# EAGLE schematic MK-312BT V1.3B (EAGLE 6.6.0)

## Sheet 1 of 5: PSU
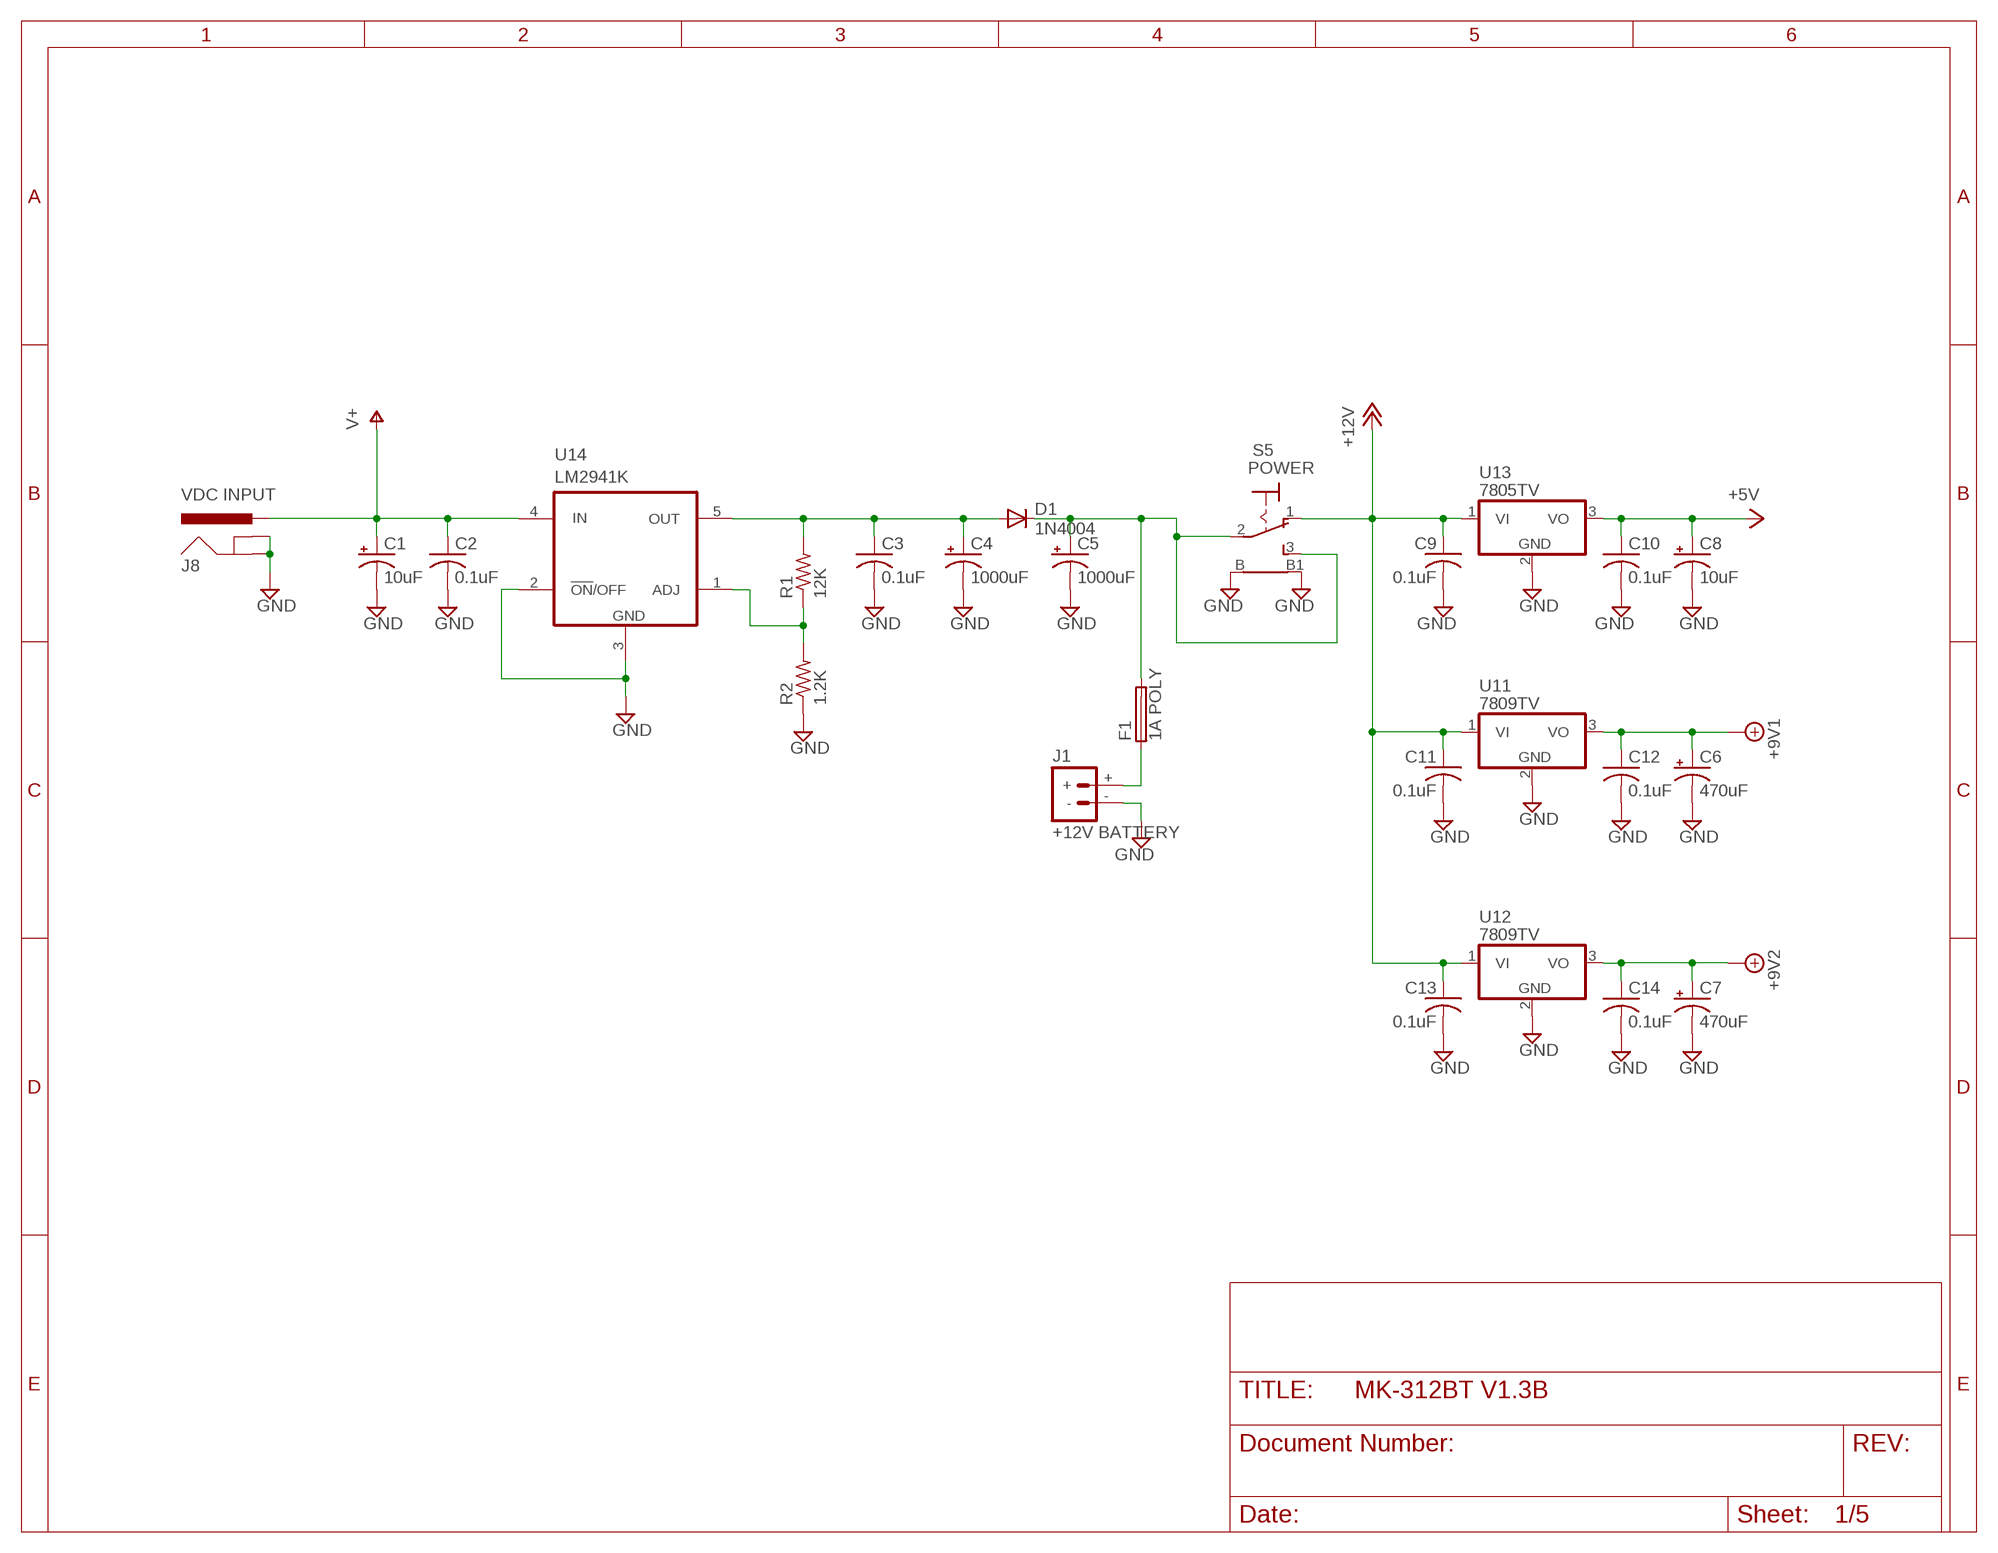
[diagram p0: schematic, sheet 1]

### Parts
C1  10uF  CPOL-USE2.5-7  [E2,5-7]
C2  0.1uF  C-US025-024X044  [C025-024X044]
C3  0.1uF  C-US025-024X044  [C025-024X044]
C4  1000uF  CPOL-USE5-10.5  [E5-10,5]
C5  1000uF  CPOL-USE5-10.5  [E5-10,5]
C6  470uF  CPOL-USE3.5-8  [E3,5-8]
C7  470uF  CPOL-USE3.5-8  [E3,5-8]
C8  10uF  CPOL-USE2.5-7  [E2,5-7]
C9  0.1uF  C-US025-024X044  [C025-024X044]
C10  0.1uF  C-US025-024X044  [C025-024X044]
C11  0.1uF  C-US025-024X044  [C025-024X044]
C12  0.1uF  C-US025-024X044  [C025-024X044]
C13  0.1uF  C-US025-024X044  [C025-024X044]
C14  0.1uF  C-US025-024X044  [C025-024X044]
D1  1N4004  [DO41-10]
F1  1A POLY  LITTLEFUSE  [LITTLEFUSE]
J1  +12V BATTERY  BATTERY_CONNDEANS  [DEANS]
J8  VDC INPUT  POWER_JACKSLT  [POWER_JACK_SLOT]
R1  12K  R-US_0207/10  [0207/10]
R2  1.2K  R-US_0207/10  [0207/10]
S5  POWER  LPV-1  [LPV-1]
U11  7809TV  7805TV  [TO220V]
U12  7809TV  7805TV  [TO220V]
U13  7805TV  [TO220V]
U14  LM2941K  [TO220-5KC]

### Nets
+5V: C8.+ C10.1 U13.3(VO) ; also sheet 2,3,4,5
+8V: C6.+ C12.1 U11.3(VO) ; supply symbol labelled +9V1 ; also sheet 5
+9V: C7.+ C14.1 U12.3(VO) ; supply symbol labelled +9V2 ; also sheet 5
+12V: C9.1 C11.1 C13.1 S5.1(O) U11.1(VI) U12.1(VI) U13.1(VI) ; also sheet 2
GND: C1.- C2.2 C3.2 C4.- C5.- C6.- C7.- C8.- C9.2 C10.2 C11.2 C12.2 C13.2 C14.2 J1.- J8.GND@1(GNDBREAK) J8.GND@2(GND) R2.1 S5.B S5.B1 U11.2(GND) U12.2(GND) U13.2(GND) U14.2(!ON!/OFF) U14.3(GND) ; also sheet 2,3,4,5
N$31: F1.1 J1.+
N$43: R1.1 R2.2 U14.1(ADJ)
N$45: C3.1 C4.+ D1.A R1.2 U14.5(OUT)
N$78: C5.+ D1.C F1.2 S5.2(P) S5.3(S)
V+: C1.+ C2.1 J8.PWR U14.4(IN) ; also sheet 2

## Sheet 2 of 5
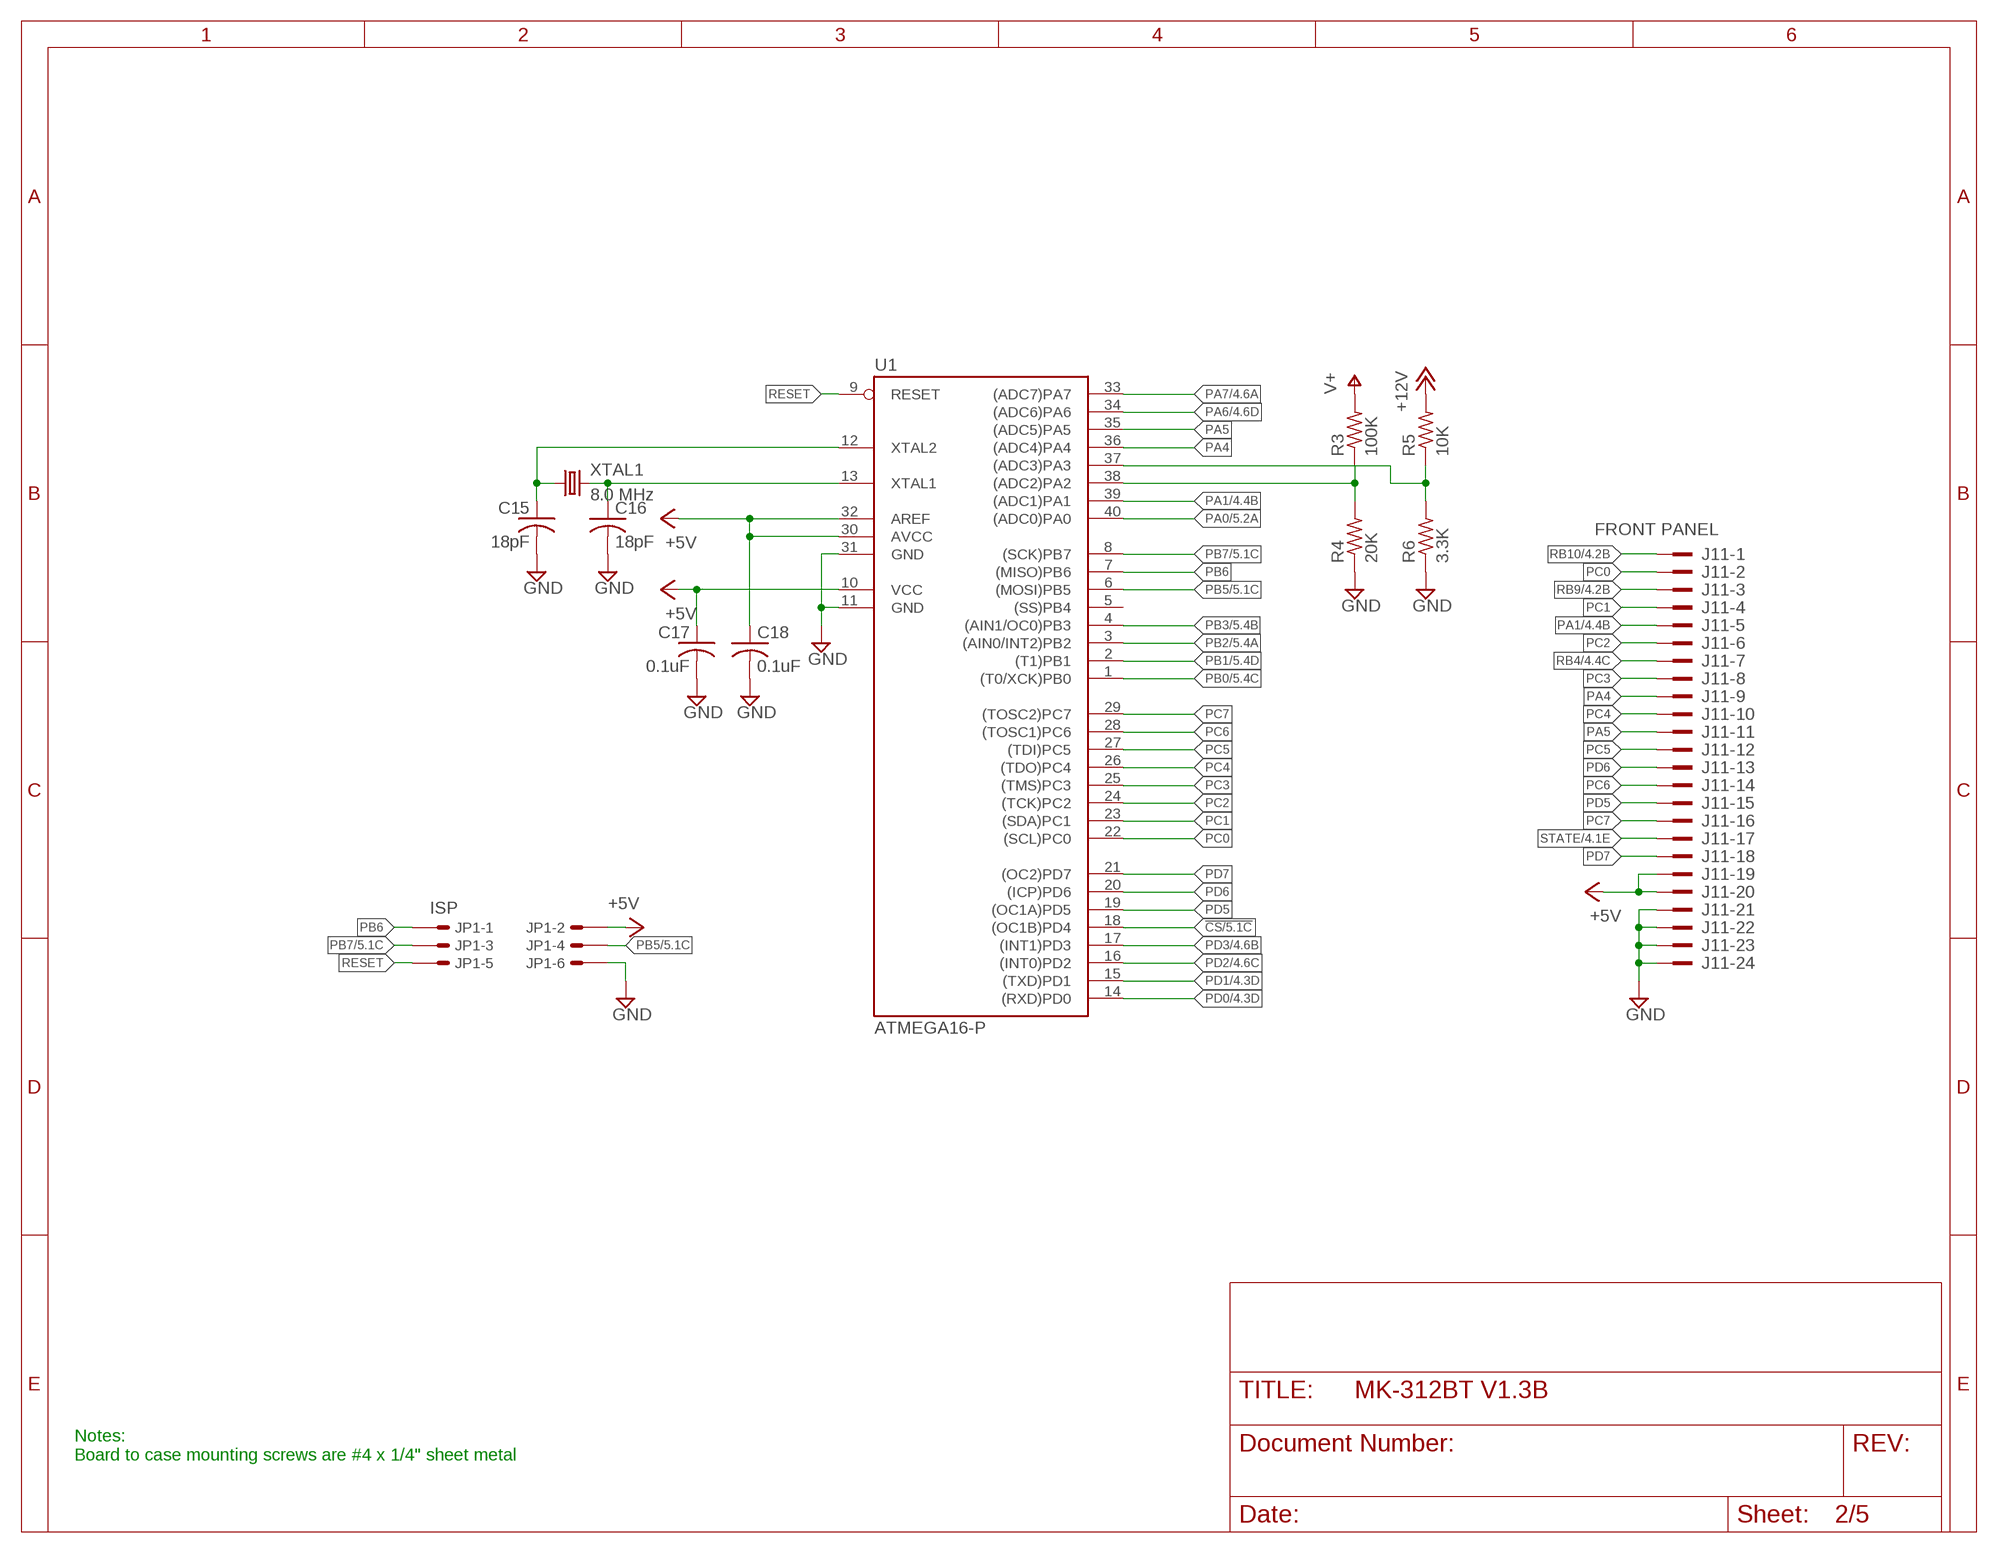
[diagram p1: schematic, sheet 2]

### Parts
C15  18pF  C-US025-024X044  [C025-024X044]
C16  18pF  C-US025-024X044  [C025-024X044]
C17  0.1uF  C-US025-024X044  [C025-024X044]
C18  0.1uF  C-US025-024X044  [C025-024X044]
J11  FRONT PANEL  2524-  [PAK100/2500-24]
JP1  ISP  057-006-1  [057-006-1]
R3  100K  R-US_0207/10  [0207/10]
R4  20K  R-US_0207/10  [0207/10]
R5  10K  R-US_0207/10  [0207/10]
R6  3.3K  R-US_0207/10  [0207/10]
U1  ATMEGA16-P  MEGA16-P  [DIL40]
XTAL1  8.0 MHz  CRYSTALHC49S  [HC49/S]

### Nets
!CS: U1.18((OC1B)PD4) ; also sheet 5
+5V: C17.1 C18.1 J11.19 J11.20 JP1.2 U1.10(VCC) U1.30(AVCC) U1.32(AREF) ; also sheet 1,3,4,5
+12V: R5.2 ; also sheet 1
GND: C15.2 C16.2 C17.2 C18.2 J11.21 J11.22 J11.23 J11.24 JP1.6 R4.1 R6.1 U1.11(GND) U1.31(GND) ; also sheet 1,3,4,5
N$2: R5.1 R6.2 U1.37((ADC3)PA3)
N$3: R3.1 R4.2 U1.38((ADC2)PA2)
N$17: C16.1 U1.13(XTAL1) XTAL1.2
N$32: C15.1 U1.12(XTAL2) XTAL1.1
PA0: U1.40((ADC0)PA0) ; also sheet 5
PA1: J11.5 U1.39((ADC1)PA1) ; also sheet 4
PA4: J11.9 U1.36((ADC4)PA4)
PA5: J11.11 U1.35((ADC5)PA5)
PA6: U1.34((ADC6)PA6) ; also sheet 4
PA7: U1.33((ADC7)PA7) ; also sheet 4
PB0: U1.1((T0/XCK)PB0) ; also sheet 5
PB1: U1.2((T1)PB1) ; also sheet 5
PB2: U1.3((AIN0/INT2)PB2) ; also sheet 5
PB3: U1.4((AIN1/OC0)PB3) ; also sheet 5
PB5: JP1.4 U1.6((MOSI)PB5) ; also sheet 5
PB6: JP1.1 U1.7((MISO)PB6)
PB7: JP1.3 U1.8((SCK)PB7) ; also sheet 5
PC0: J11.2 U1.22((SCL)PC0) ; also sheet 3
PC1: J11.4 U1.23((SDA)PC1) ; also sheet 3
PC2: J11.6 U1.24((TCK)PC2) ; also sheet 3
PC3: J11.8 U1.25((TMS)PC3) ; also sheet 3
PC4: J11.10 U1.26((TDO)PC4) ; also sheet 3
PC5: J11.12 U1.27((TDI)PC5) ; also sheet 3
PC6: J11.14 U1.28((TOSC1)PC6) ; also sheet 3
PC7: J11.16 U1.29((TOSC2)PC7) ; also sheet 3
PD0: U1.14((RXD)PD0) ; also sheet 4
PD1: U1.15((TXD)PD1) ; also sheet 4
PD2: U1.16((INT0)PD2) ; also sheet 4
PD3: U1.17((INT1)PD3) ; also sheet 4
PD5: J11.15 U1.19((OC1A)PD5) ; also sheet 3
PD6: J11.13 U1.20((ICP)PD6) ; also sheet 3
PD7: J11.18 U1.21((OC2)PD7) ; also sheet 3
RB4: J11.7 ; also sheet 4
RB9: J11.3 ; also sheet 4
RB10: J11.1 ; also sheet 4
RESET: JP1.5 U1.9(RESET)
STATE: J11.17 ; also sheet 4
V+: R3.2 ; also sheet 1
Unconnected: U1.5((SS)PB4)

### Notes on the sheet
- Notes:
  Board to case mounting screws are #4 x 1/4" sheet metal

## Sheet 3 of 5: Small PCB
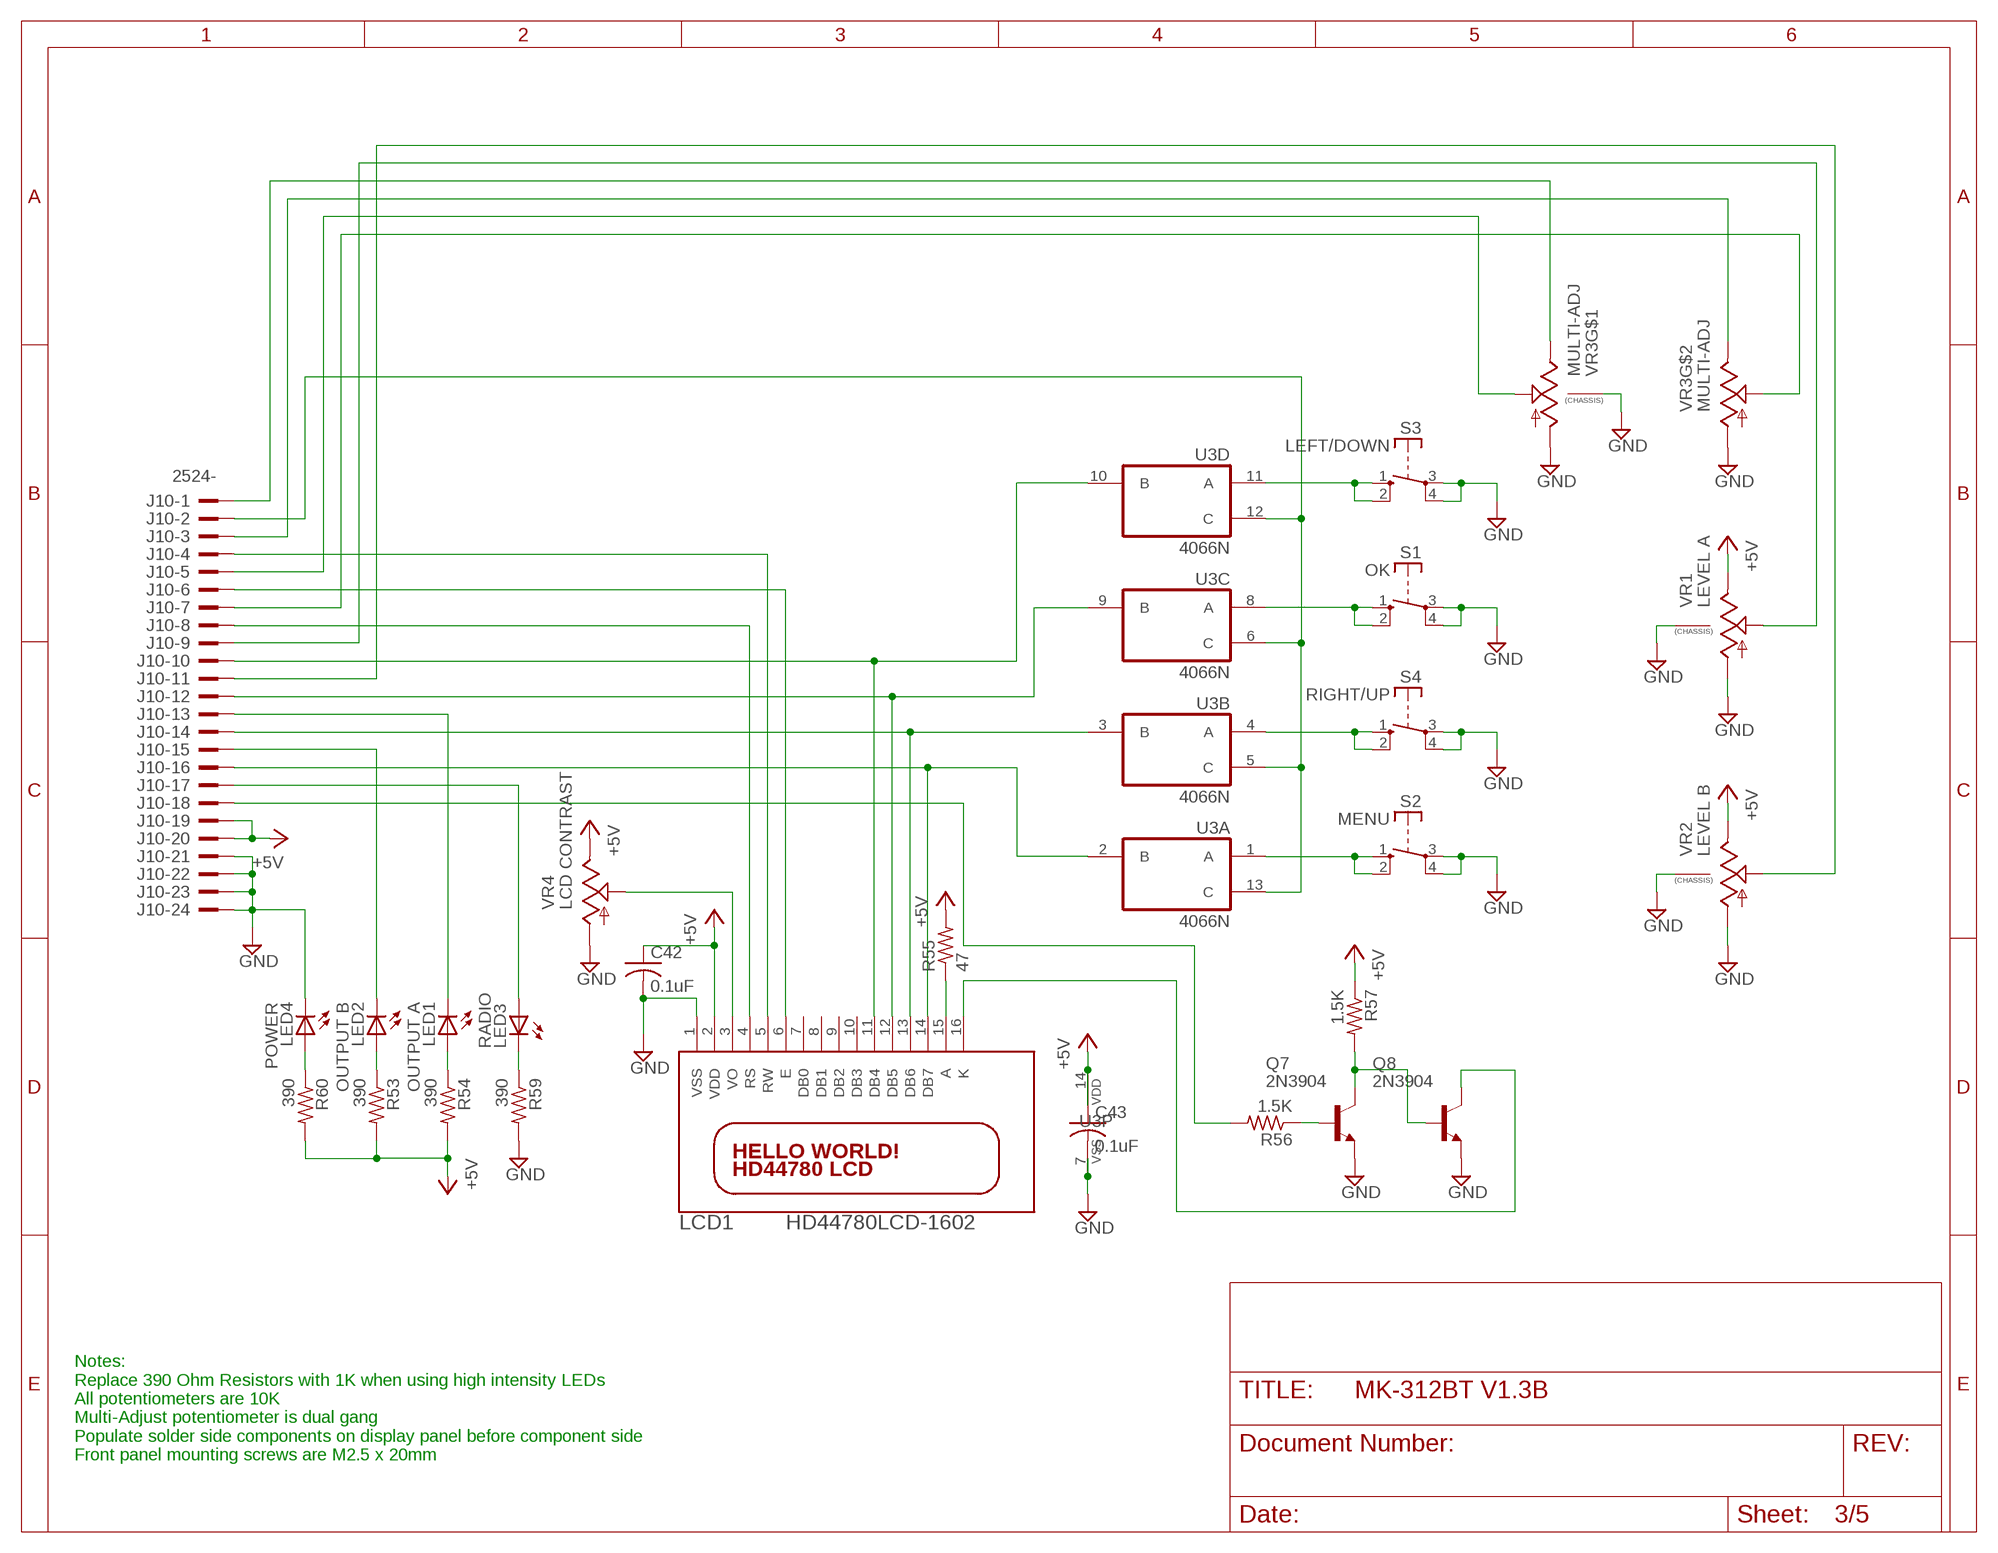
[diagram p2: schematic, sheet 3]

### Parts
C42  0.1uF  C-US025-024X044  [C025-024X044]
C43  0.1uF  C-US025-024X044  [C025-024X044]
J10  2524-  [PAK100/2500-24]
LCD1  HD44780LCD-1602  [LCD1602]
LED1  OUTPUT A  LED5MM  [LED5MM]
LED2  OUTPUT B  LED5MM  [LED5MM]
LED3  RADIO  LED5MM  [LED5MM]
LED4  POWER  LED5MM  [LED5MM]
Q7  2N3904  [TO92]
Q8  2N3904  [TO92]
R53  390  R-US_0207/10  [0207/10]
R54  390  R-US_0207/10  [0207/10]
R55  47  R-US_0207/10  [0207/10]
R56  1.5K  R-US_0207/10  [0207/10]
R57  1.5K  R-US_0207/10  [0207/10]
R59  390  R-US_0207/10  [0207/10]
R60  390  R-US_0207/10  [0207/10]
S1  OK  DTE6K  [DTE6K]
S2  MENU  DTE6K  [DTE6K]
S3  LEFT/DOWN  DTE6K  [DTE6K]
S4  RIGHT/UP  DTE6K  [DTE6K]
U3  4066N  [DIL14]
VR1  LEVEL A  9MM_SNAP-IN_POT_CHASSIS  [9MM_SNAP-IN_POT]
VR2  LEVEL B  9MM_SNAP-IN_POT_CHASSIS  [9MM_SNAP-IN_POT]
VR3  MULTI-ADJ  ALPHA-9MM-DUALPOT  [DUAL_9MM_SNAP-IN_POT]
VR4  LCD CONTRAST  TRIM_US-B25P  [B25P]

### Nets
+5V: C42.1 C43.1 J10.19 J10.20 LCD1.2(VDD) R53.2 R54.2 R55.2 R57.1 R60.2 U3.14(P:VDD) VR1.3(E) VR2.3(E) VR4.E ; also sheet 1,2,4,5
GND: C42.2 C43.2 J10.21 J10.22 J10.23 J10.24 LCD1.1(VSS) LED4.K(C) Q7.3(E) Q8.3(E) R59.2 S1.3(P) S1.4(P) S2.3(P) S2.4(P) S3.3(P) S3.4(P) S4.3(P) S4.4(P) U3.7(P:VSS) VR1.1(A) VR1.CHASSIS2 VR2.1(A) VR2.CHASSIS2 VR3.1(A) VR3.1B(A) VR3.CHASSIS1 VR3.CHASSIS2 VR4.A ; also sheet 1,2,4,5
N$1: J10.7 VR3.2B(S)
N$4: S1.1(S) S1.2(S) U3.8(C:A)
N$5: S3.1(S) S3.2(S) U3.11(D:A)
N$7: S4.1(S) S4.2(S) U3.4(B:A)
N$10: J10.3 VR3.3B(E)
N$11: J10.9 VR1.2(S)
N$12: J10.11 VR2.2(S)
N$13: J10.1 VR3.3(E)
N$15: J10.5 VR3.2(S)
N$23: LED2.A R53.1
N$29: LED1.A R54.1
N$30: LCD1.3(VO) VR4.S
N$47: LCD1.15(A) R55.1
N$79: LED3.K(C) R59.1
N$80: S2.1(S) S2.2(S) U3.1(A:A)
N$81: LED4.A R60.1
N$82: Q7.2(B) R56.1
N$83: Q7.1(C) Q8.2(B) R57.2
N$84: LCD1.16(K) Q8.1(C)
N$86: J10.17 LED3.A
PC0: J10.2 U3.5(B:C) U3.6(C:C) U3.12(D:C) U3.13(A:C) ; also sheet 2
PC1: J10.4 LCD1.5(RW) ; also sheet 2
PC2: J10.6 LCD1.6(E) ; also sheet 2
PC3: J10.8 LCD1.4(RS) ; also sheet 2
PC4: J10.10 LCD1.11(DB4) U3.10(D:B) ; also sheet 2
PC5: J10.12 LCD1.12(DB5) U3.9(C:B) ; also sheet 2
PC6: J10.14 LCD1.13(DB6) U3.3(B:B) ; also sheet 2
PC7: J10.16 LCD1.14(DB7) U3.2(A:B) ; also sheet 2
PD5: J10.15 LED2.K(C) ; also sheet 2
PD6: J10.13 LED1.K(C) ; also sheet 2
PD7: J10.18 R56.2 ; also sheet 2
Unconnected: LCD1.7(DB0) LCD1.8(DB1) LCD1.9(DB2) LCD1.10(DB3)

### Notes on the sheet
- Notes:
  Replace 390 Ohm Resistors with 1K when using high intensity LEDs
  All potentiometers are 10K
  Multi-Adjust potentiometer is dual gang
  Populate solder side components on display panel before component side
  Front panel mounting screws are M2.5 x 20mm

## Sheet 4 of 5: Input stage
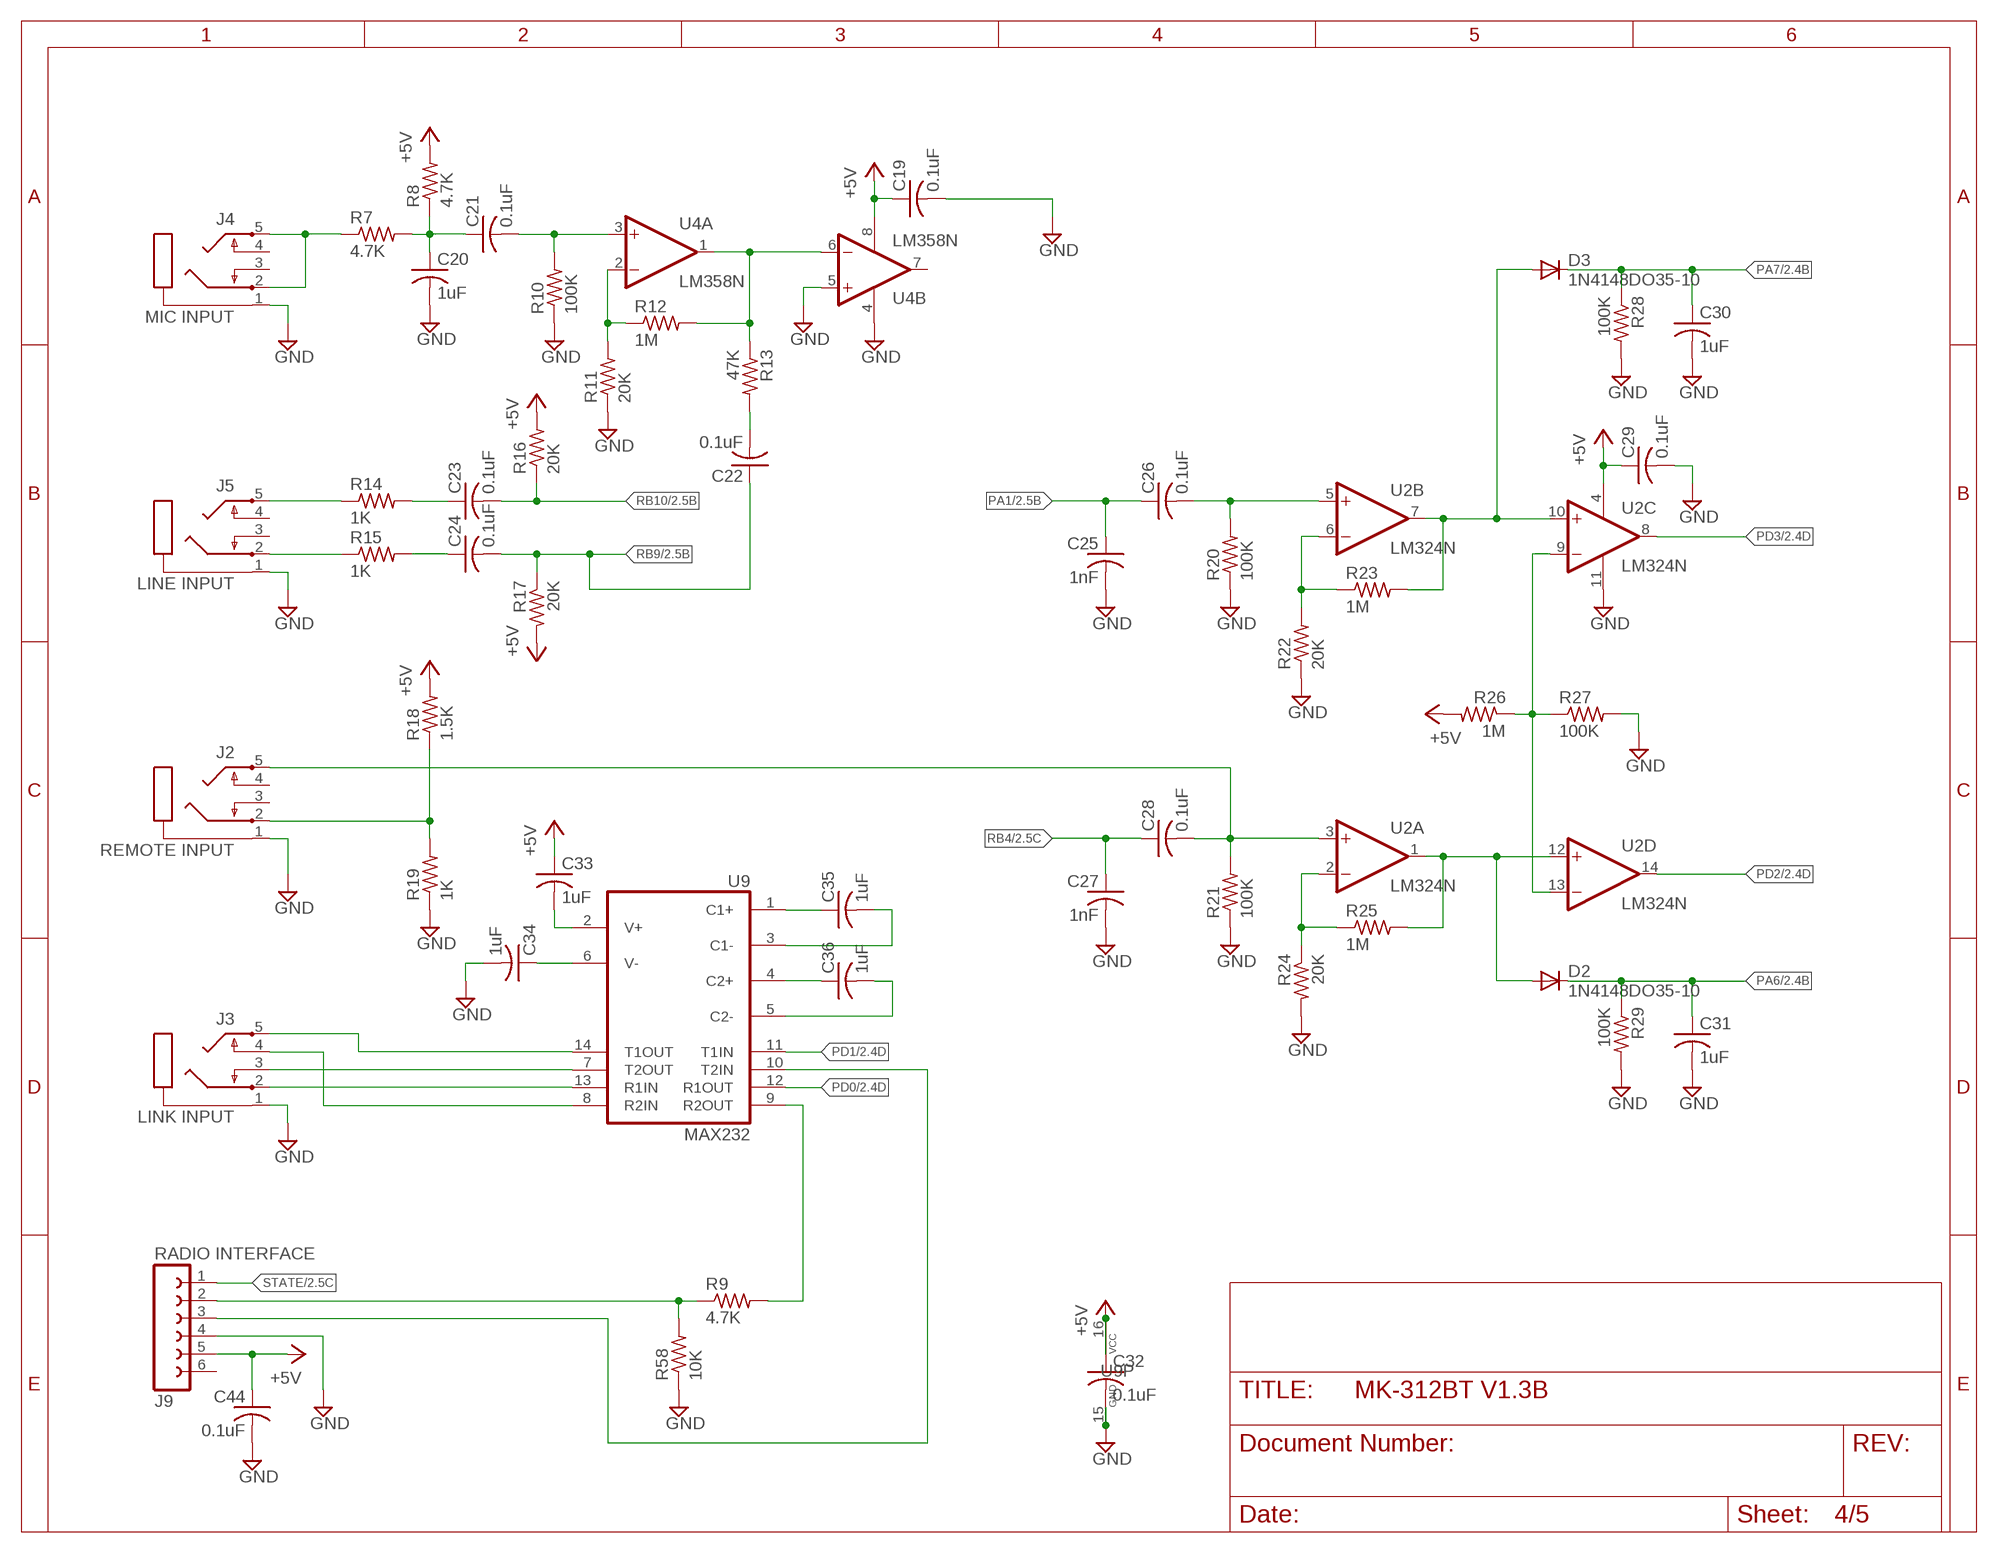
[diagram p3: schematic, sheet 4]

### Parts
C19  0.1uF  C-US025-024X044  [C025-024X044]
C20  1uF  C-US025-024X044  [C025-024X044]
C21  0.1uF  C-US025-024X044  [C025-024X044]
C22  0.1uF  C-US025-024X044  [C025-024X044]
C23  0.1uF  C-US025-024X044  [C025-024X044]
C24  0.1uF  C-US025-024X044  [C025-024X044]
C25  1nF  C-US025-024X044  [C025-024X044]
C26  0.1uF  C-US025-024X044  [C025-024X044]
C27  1nF  C-US025-024X044  [C025-024X044]
C28  0.1uF  C-US025-024X044  [C025-024X044]
C29  0.1uF  C-US025-024X044  [C025-024X044]
C30  1uF  C-US025-024X044  [C025-024X044]
C31  1uF  C-US025-024X044  [C025-024X044]
C32  0.1uF  C-US025-024X044  [C025-024X044]
C33  1uF  C-US025-024X044  [C025-024X044]
C34  1uF  C-US025-024X044  [C025-024X044]
C35  1uF  C-US025-024X044  [C025-024X044]
C36  1uF  C-US025-024X044  [C025-024X044]
C44  0.1uF  C-US025-024X044  [C025-024X044]
D2  1N4148DO35-10  [DO35-10]
D3  1N4148DO35-10  [DO35-10]
J2  REMOTE INPUT  STEREOJACK  [STX3100]
J3  LINK INPUT  STEREOJACK  [STX3100]
J4  MIC INPUT  STEREOJACK  [STX3100]
J5  LINE INPUT  STEREOJACK  [STX3100]
J9  RADIO INTERFACE  FE06-1  [FE06]
R7  4.7K  R-US_0207/10  [0207/10]
R8  4.7K  R-US_0207/10  [0207/10]
R9  4.7K  R-US_0207/10  [0207/10]
R10  100K  R-US_0207/10  [0207/10]
R11  20K  R-US_0207/10  [0207/10]
R12  1M  R-US_0207/10  [0207/10]
R13  47K  R-US_0207/10  [0207/10]
R14  1K  R-US_0207/10  [0207/10]
R15  1K  R-US_0207/10  [0207/10]
R16  20K  R-US_0207/10  [0207/10]
R17  20K  R-US_0207/10  [0207/10]
R18  1.5K  R-US_0207/10  [0207/10]
R19  1K  R-US_0207/10  [0207/10]
R20  100K  R-US_0207/10  [0207/10]
R21  100K  R-US_0207/10  [0207/10]
R22  20K  R-US_0207/10  [0207/10]
R23  1M  R-US_0207/10  [0207/10]
R24  20K  R-US_0207/10  [0207/10]
R25  1M  R-US_0207/10  [0207/10]
R26  1M  R-US_0207/10  [0207/10]
R27  100K  R-US_0207/10  [0207/10]
R28  100K  R-US_0207/10  [0207/10]
R29  100K  R-US_0207/10  [0207/10]
R58  10K  R-US_0207/10  [0207/10]
U2  LM324N  [DIL14]
U4  LM358N  [DIL08]
U9  MAX232  [DIL16]

### Nets
+5V: C19.1 C29.1 C32.1 C33.1 C44.1 J9.5 R8.2 R16.2 R17.2 R18.2 R26.2 U2.4(P:V+) U4.8(P:V+) U9.16(VCC) ; also sheet 1,2,3,5
GND: C19.2 C20.2 C25.2 C27.2 C29.2 C30.2 C31.2 C32.2 C34.2 C44.2 J2.1 J3.1 J4.1 J5.1 J9.4 R10.1 R11.1 R19.1 R20.1 R21.1 R22.1 R24.2 R27.2 R28.2 R29.2 R58.1 U2.11(P:V-) U4.4(P:V-) U4.5(B:+IN) U9.15(GND) ; also sheet 1,2,3,5
N$14: C28.2 J2.5 R21.2 U2.3(A:+IN)
N$33: R9.2 U9.9(R2OUT)
N$44: J3.5 U9.14(T1OUT)
N$46: J3.2 U9.13(R1IN)
N$52: C35.1 U9.1(C1+)
N$53: R24.1 R25.1 U2.2(A:-IN)
N$54: D2.A R25.2 U2.1(A:OUT) U2.12(D:+IN)
N$55: J5.2 R15.1
N$56: J5.5 R14.1
N$57: C23.1 R14.2
N$58: J2.2 R18.1 R19.2
N$60: R22.2 R23.1 U2.6(B:-IN)
N$61: C35.2 U9.3(C1-)
N$62: R26.1 R27.1 U2.9(C:-IN) U2.13(D:-IN)
N$63: C26.2 R20.2 U2.5(B:+IN)
N$65: C24.1 R15.2
N$66: C36.2 U9.5(C2-)
N$67: C36.1 U9.4(C2+)
N$68: J9.2 R9.1 R58.2
N$69: D3.A R23.2 U2.7(B:OUT) U2.10(C:+IN)
N$70: C34.1 U9.6(V-)
N$71: J4.2 J4.5 R7.1
N$72: C20.1 C21.1 R7.2 R8.1
N$73: C21.2 R10.2 U4.3(A:+IN)
N$74: R11.2 R12.1 U4.2(A:-IN)
N$75: R12.2 R13.1 U4.1(A:OUT) U4.6(B:-IN)
N$76: C22.2 R13.2
N$77: C33.2 U9.2(V+)
N$87: J3.4 U9.8(R2IN)
N$88: J3.3 U9.7(T2OUT)
N$89: J9.3 U9.10(T2IN)
PA1: C25.1 C26.1 ; also sheet 2
PA6: C31.1 D2.C R29.1 ; also sheet 2
PA7: C30.1 D3.C R28.1 ; also sheet 2
PD0: U9.12(R1OUT) ; also sheet 2
PD1: U9.11(T1IN) ; also sheet 2
PD2: U2.14(D:OUT) ; also sheet 2
PD3: U2.8(C:OUT) ; also sheet 2
RB4: C27.1 C28.1 ; also sheet 2
RB9: C22.1 C24.2 R17.1 ; also sheet 2
RB10: C23.2 R16.1 ; also sheet 2
STATE: J9.1 ; also sheet 2
Unconnected: J2.3 J2.4 J4.3 J4.4 J5.3 J5.4 J9.6 U4.7(B:OUT)

## Sheet 5 of 5: Output stage
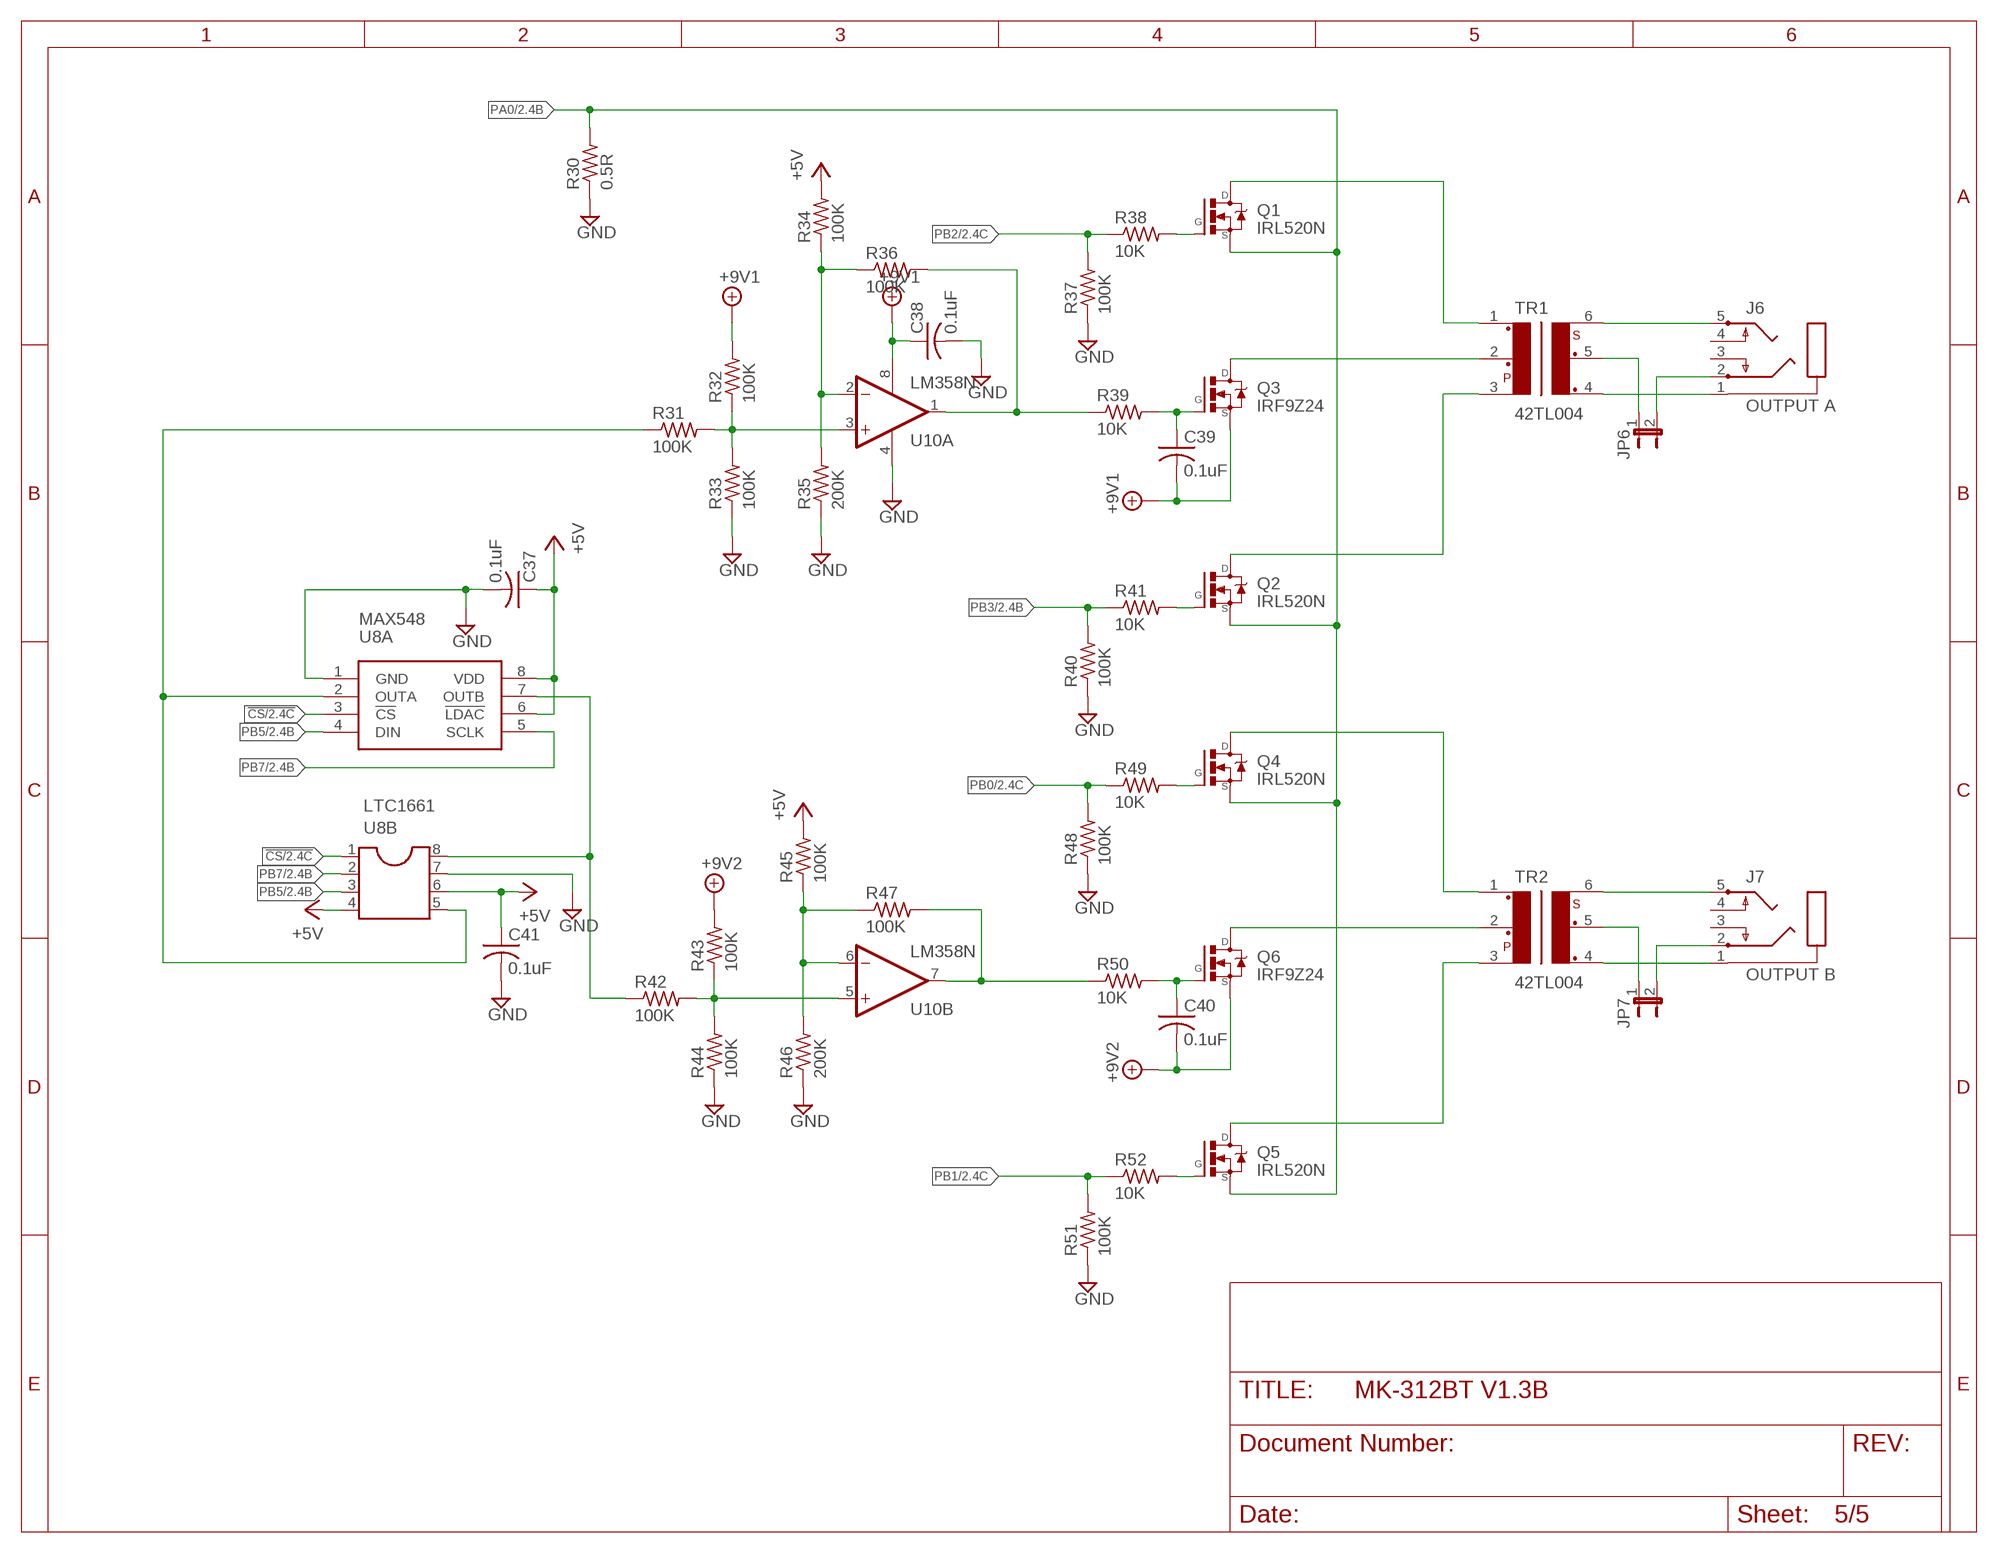
[diagram p4: schematic, sheet 5]

### Parts
C37  0.1uF  C-US025-024X044  [C025-024X044]
C38  0.1uF  C-US025-024X044  [C025-024X044]
C39  0.1uF  C-US025-024X044  [C025-024X044]
C40  0.1uF  C-US025-024X044  [C025-024X044]
C41  0.1uF  C-US025-024X044  [C025-024X044]
J6  OUTPUT A  STEREOJACK  [STX3100]
J7  OUTPUT B  STEREOJACK  [STX3100]
JP6  JP1E  [JP1]
JP7  JP1E  [JP1]
Q1  IRL520N  IRL530N-V  [TO220V]
Q2  IRL520N  IRL530N-V  [TO220V]
Q3  IRF9Z24  IRL530N-V  [TO220V]
Q4  IRL520N  IRL530N-V  [TO220V]
Q5  IRL520N  IRL530N-V  [TO220V]
Q6  IRF9Z24  IRL530N-V  [TO220V]
R30  0.5R  R-US_0309/12  [0309/12]
R31  100K  R-US_0207/10  [0207/10]
R32  100K  R-US_0207/10  [0207/10]
R33  100K  R-US_0207/10  [0207/10]
R34  100K  R-US_0207/10  [0207/10]
R35  200K  R-US_0207/10  [0207/10]
R36  100K  R-US_0207/10  [0207/10]
R37  100K  R-US_0207/10  [0207/10]
R38  10K  R-US_0207/10  [0207/10]
R39  10K  R-US_0207/10  [0207/10]
R40  100K  R-US_0207/10  [0207/10]
R41  10K  R-US_0207/10  [0207/10]
R42  100K  R-US_0207/10  [0207/10]
R43  100K  R-US_0207/10  [0207/10]
R44  100K  R-US_0207/10  [0207/10]
R45  100K  R-US_0207/10  [0207/10]
R46  200K  R-US_0207/10  [0207/10]
R47  100K  R-US_0207/10  [0207/10]
R48  100K  R-US_0207/10  [0207/10]
R49  10K  R-US_0207/10  [0207/10]
R50  10K  R-US_0207/10  [0207/10]
R51  100K  R-US_0207/10  [0207/10]
R52  10K  R-US_0207/10  [0207/10]
TR1  42TL004  42TL023  [42TL]
TR2  42TL004  42TL023  [42TL]
U8A  MAX548  [DIL08]
U8B  LTC1661  DIL8S  [SOCKET-08]
U10  LM358N  [DIL08]

### Nets
!CS: U8A.3(!CS) U8B.1 ; also sheet 2
+5V: C37.1 C41.1 R34.2 R45.2 U8A.6(!LDAC) U8A.8(VDD) U8B.4 U8B.6 ; also sheet 1,2,3,4
+8V: C38.1 C39.2 Q3.3(S) R32.2 U10.8(P:V+) ; supply symbol labelled +9V1 ; also sheet 1
+9V: C40.2 Q6.3(S) R43.2 ; supply symbol labelled +9V2 ; also sheet 1
GND: C37.2 C38.2 C41.2 R30.1 R33.1 R35.1 R37.1 R40.1 R44.1 R46.1 R48.1 R51.1 U8A.1(GND) U8B.7 U10.4(P:V-) ; also sheet 1,2,3,4
N$6: J6.1 TR1.4
N$9: JP7.1 TR2.5
N$16: J6.5 TR1.6
N$18: Q1.1(G) R38.2
N$19: Q2.1(G) R41.2
N$20: J7.2 JP7.2
N$21: C39.1 Q3.1(G) R39.2
N$22: R31.2 R32.1 R33.2 U10.3(A:+IN)
N$24: Q4.1(G) R49.2
N$25: Q5.1(G) R52.2
N$27: C40.1 Q6.1(G) R50.2
N$28: R42.2 R43.1 R44.2 U10.5(B:+IN)
N$34: Q1.2(D) TR1.1
N$35: Q3.2(D) TR1.2
N$36: Q4.2(D) TR2.1
N$37: Q6.2(D) TR2.2
N$38: Q5.2(D) TR2.3
N$39: Q2.2(D) TR1.3
N$40: R34.1 R35.2 R36.1 U10.2(A:-IN)
N$41: R45.1 R46.2 R47.1 U10.6(B:-IN)
N$42: R31.1 U8A.2(OUTA) U8B.5
N$48: J6.2 JP6.2
N$49: J7.5 TR2.6
N$50: J7.1 TR2.4
N$51: JP6.1 TR1.5
N$85: R42.1 U8A.7(OUTB) U8B.8
PA0: Q1.3(S) Q2.3(S) Q4.3(S) Q5.3(S) R30.2 ; also sheet 2
PB0: R48.2 R49.1 ; also sheet 2
PB1: R51.2 R52.1 ; also sheet 2
PB2: R37.2 R38.1 ; also sheet 2
PB3: R40.2 R41.1 ; also sheet 2
PB5: U8A.4(DIN) U8B.3 ; also sheet 2
PB7: U8A.5(SCLK) U8B.2 ; also sheet 2
PFET_A: R36.2 R39.1 U10.1(A:OUT)
PFET_B: R47.2 R50.1 U10.7(B:OUT)
Unconnected: J6.3 J6.4 J7.3 J7.4

## Library data of the parts
C1 C4-C8 = rcl:CPOL-US: POLARIZED CAPACITOR, American symbol
C2 C3 C9-C44 = rcl:C-US: CAPACITOR, American symbol
D1 = diode:1N4004: DIODE general purpose rectifier, 1 A
D2 D3 = diode:1N4148: DIODE high speed (Philips)
F1 = fuse:LITTLEFUSE: LITTLEFUSE Picofuse/slow Littlefuse; OC_FARNELL: unknown; OC_NEWARK: unknown
J1 = SparkFun-Connectors:BATTERY_CONN: Various footprints for battery connectors
J2-J7 = adafruit:STEREOJACK: MIC/HEADPHONE JACK Stereo jack with two switches. Kycon STX3100, CUI SJ1-3555NG and/or 4UCon 05544
J8 = SparkFun-Connectors:POWER_JACK: Power Jack This is the standard 5.5mm barrel jack for power. The PTH is the most common, proven, reliable, footprint. The Slot footprint only works if the mill layer is transmitted to the PCB fab house so be warned. Mating wall wart : TOL-00298 (and others); PROD_ID: PRT-00119
J9 = con-lsta:FE06-1: FEMALE HEADER; OC_FARNELL: unknown; OC_NEWARK: unknown
J10 J11 = con-3m:2524-: 3M (TM) Pak 100 4-Wall Header Source: 3M; OC_FARNELL: unknown; OC_NEWARK: unknown
JP1 = con-panduit:057-006-: CONNECTOR 6-pin series 057 contact pc board low profile headers; OC_FARNELL: unknown; OC_NEWARK: unknown
JP6 JP7 = jumper:JP1E: JUMPER
LCD1 = adafruit:HD44780LCD: HD44780 LCD Standard character type LCDs, available in sizes from 8x1 to 40x4!
LED1-LED4 = led:LED: LED OSRAM: - CHIPLED LG R971, LG N971, LY N971, LG Q971, LY Q971, LO R971, LY R971 LH N974, LH R974 LS Q976, LO Q976, LY Q976 LO Q996 - Hyper CHIPLED LW Q18S LB Q993, LB Q99A, LB R99A - SideLED LS A670, LO A670, LY A670, LG A670, LP A670 LB A673, LV A673, LT A673, LW A673 LH A674 LY A675 LS A676, LA A676, LO A676, LY A676, LW A676 LS A679, LY A679, LG A679 - Hyper Micro SIDELED® LS Y876, LA Y876, LO Y876, LY Y876 LT Y87S - SmartLED LW L88C, LW L88S LB L89C, LB L89S, LG L890 LS L89K, LO L89K, LY L89K LS L896, LA L896, LO L896, LY L896 - TOPLED LS T670, LO T670, LY T670, LG T670, LP T670 LSG T670, LSP T670, LSY T670, LOP T670, LYG T670 LG T671, LOG T671, LSG T671 LB T673, LV T673, LT T673, LW T673 LH T674 LS T676, LA T676, LO T676, LY T676, LB T676, LH T676, LSB T676, LW T676 LB T67C, LV T67C, LT T67C, LS T67K, LO T67K, LY T67K, LW E67C LS E67B, LA E67B, LO E67B, LY E67B, LB E67C, LV E67C, LT E67C LW T67C LS T679, LY T679, LG T679 LS T770, LO T770, LY T770, LG T770, LP T770 LB T773, LV T773, LT T773, LW T773 LH T774 LS E675, LA E675, LY E675, LS T675 LS T776, LA T776, LO T776, LY T776, LB T776 LHGB T686 LT T68C, LB T68C - Hyper Mini TOPLED® LB M676 - Mini TOPLED Santana® LG M470 LS M47K, LO M47K, LY M47K Source: http://www.osram.convergy.de LUXEON: - LUMILED® LXK2-PW12-R00, LXK2-PW12-S00, LXK2-PW14-U00, LXK2-PW14-V00 LXK2-PM12-R00, LXK2-PM12-S00, LXK2-PM14-U00 LXK2-PE12-Q00, LXK2-PE12-R00, LXK2-PE12-S00, LXK2-PE14-T00, LXK2-PE14-U00 LXK2-PB12-K00, LXK2-PB12-L00, LXK2-PB12-M00, LXK2-PB14-N00, LXK2-PB14-P00, LXK2-PB14-Q00 LXK2-PR12-L00, LXK2-PR12-M00, LXK2-PR14-Q00, LXK2-PR14-R00 LXK2-PD12-Q00, LXK2-PD12-R00, LXK2-PD12-S00 LXK2-PH12-R00, LXK2-PH12-S00 LXK2-PL12-P00, LXK2-PL12-Q00, LXK2-PL12-R00 Source: www.luxeon.com KINGBRIGHT: KA-3528ASYC Source: www.kingbright.com
Q1-Q6 = transistor-fet-1:IRL530: MOSFET 17A 22.7nC 100mOhm Logic Level
Q7 Q8 = transistor-neu-to92:2N3904: NPN TRANSISTOR
R1-R60 = rcl:R-US_: RESISTOR, American symbol
S1-S4 = switch-misc:DT: ITT SWITCH
S5 = switch:LPV-1: TOGGLE SWITCH
TR1 TR2 = trafo-xicon:42T?*: Xicon Micro-Mini EI-12 Audio Transformers 42TL/42TC/42TM Series Source: http://www.mouser.com//catalog/specsheets/164201.pdf http://www.mouser.com/catalog/specsheets/114225.pdf http://www.mouser.com/catalog/specsheets/164267.pdf; OC_FARNELL: unknown; OC_NEWARK: unknown
U1 = atmel:MEGA16-P: MICROCONTROLLER 16 Kbytes FLASH 1 kbytes SRAM 512 bytes EEPROM USART 8-channel 10 bit ADC Source: avr.lbr; MPN: ATMEGA16-16PU; OC_FARNELL: 9171142; OC_NEWARK: 01M6885
U2 = linear:LM324: OP AMP
U3 = 40xx:4066: Quad bilateral ANALOG SWITCH
U4 U10 = linear:LM358: OP AMP also LM158; LM258; LM2904 Source: http://cache.national.com/ds/LM/LM158.pdf
U8A = JAEB:MAX548
U8B = ic-package:DIL8: Dual In Line / Socket
U9 = maxim:MAX232: RS232 TRANSCEIVER; MF: MAXIM; MPN: MAX232ACPE+; OC_FARNELL: 9723773; OC_NEWARK: 68K4544
U11-U13 = linear:78*: Positive VOLTAGE REGULATOR Source: http://cache.national.com/ds/LM/LM78L05.pdf http://www.fairchildsemi.com/ds/LM/LM7805.pdf
U14 = national-semi:LM2941: LDO REGULATOR
VR1 VR2 = MusicThingModular:9MM_SNAP-IN_POT_CHASSIS: 9mm vertical snap-in pot, Alpha / Panasonic style, with a connection to the metal chassis for grounding
VR3 = MusicThingModular:ALPHA-9MM-DUALPOT: 9mm vertical snap-in pot, Alpha / Panasonic style, with a connection to the metal chassis for grounding
VR4 = pot:TRIM_US-: POTENTIOMETER
XTAL1 = crystal:CRYSTAL: CRYSTAL; OC_FARNELL: 1667008; OC_NEWARK: unknown

## Net classes
0 default: width 0.4 mm
1 signal: width 0.254 mm
2 pwr: width 2 mm